# Altium schematic sheet 总体电路图.SCHDOC
size A4
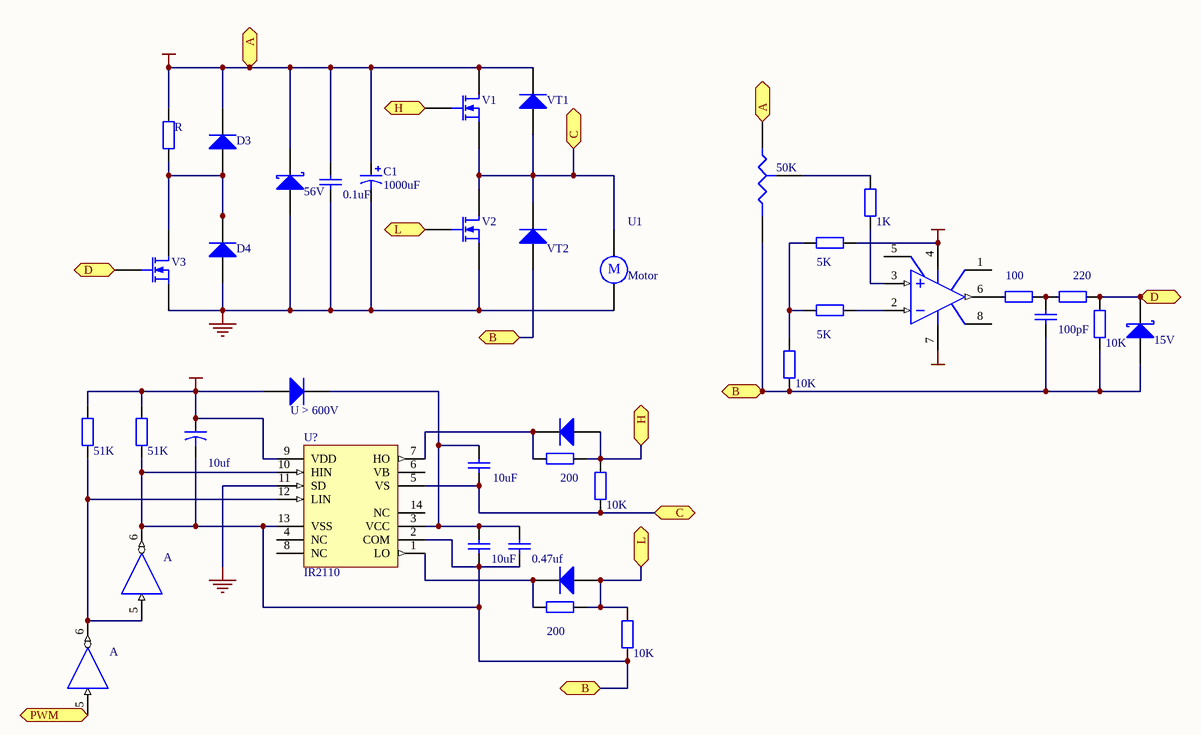
[diagram p0: 总体电路图.SCHDOC]

## Parts
(Parts that share a designator on the sheet are numbered #1, #2 ... from top to bottom, then left to right.)
?#1  value 50K  [VR3]
?#2  56V  [SO-G3/C2.5]
?#3  value 0.1uF  [CAPR2.54-5.1X3.2]
?#4  value 1K  [AXIAL-0.5]
?#5  VT2  [DIO18.84-9.6x5.6]
?#6  Motor  [RB5-10.5]
?#7  value 5K  [AXIAL-0.5]
?#8  value 100  [AXIAL-0.5]
?#9  value 220  [AXIAL-0.5]
?#10  value 5K  [AXIAL-0.5]
?#11  (no value)  [CAN-8/D9.4]
?#12  value 100pF  [CAPR2.54-5.1X3.2]
?#13  value 10K  [AXIAL-0.5]
?#14  15V  [SO-G3/C2.5]
?#15  value 10K  [AXIAL-0.5]
?#16  U > 600V  [DSO-C2/X3.3]
?#17  value 10uf  [CAPR5-4X5]
?#18  value 51K  [AXIAL-0.5]
?#19  value 51K  [AXIAL-0.5]
?#20  value 200  [AXIAL-0.5]
?#21  (no value)  [DSO-C2/X3.3]
?#22  value 10uF  [CAPR2.54-5.1X3.2]
?#23  value 10K  [AXIAL-0.5]
?#24  value 10uF  [CAPR2.54-5.1X3.2]
?#25  value 0.47uf  [CAPR2.54-5.1X3.2]
?#26  (no value)  [FK020D]  (part A of 6)
?#27  (no value)  [DSO-C2/X3.3]
?#28  value 200  [AXIAL-0.5]
?#29  value 10K  [AXIAL-0.5]
?#30  (no value)  [FK020D]  (part A of 6)
C1  1000uF  [CAPPA14.05-10.5x6.3]
D3  (no value)  [DIO18.84-9.6x5.6]
D4  (no value)  [DSO-C2/X3.3]
R  (no value)  [AXIAL-0.5]
U?  IR2110  [PDIP14]
V1  (no value)  [BCY-W3/H.8]
V2  (no value)  [BCY-W3/H.8]
V3  (no value)  [BCY-W3/H.8]
VT1  (no value)  [DIO18.84-9.6x5.6]

## Ports
A, B, C, D, H, L, PWM

## Nets
+15V: ?#7.1 ?#11.4(V-) ?#16.1(A) ?#17.1 ?#18.2 ?#19.2 U?.9(VDD)
+48V: ?#1.1(A) ?#2.3(K) ?#3.2 C1.1 D3.2(K) R.2 V1.1(D) VT1.2(K) ; port A
-15V: ?#11.7(V+)
GND: ?#26.9(GND) ?#26.10(GND) ?#26.11(GND) ?#26.12(GND) ?#30.9(GND) ?#30.10(GND) ?#30.11(GND) ?#30.12(GND)
VCC: ?#2.1(A) ?#3.1 ?#6.2 ?#26.1(VCC) ?#26.20(VCC) ?#30.1(VCC) ?#30.20(VCC) C1.2 D4.1(A) U?.11(SD) V2.3(S) V3.3(S)
B: ?#1.2(B) ?#5.1(A) ?#12.1 ?#13.1 ?#14.1(A) ?#15.2 ?#17.2 ?#19.1 ?#24.1 ?#25.1 ?#26.6(Y) ?#29.1 U?.2(COM) U?.10(HIN) U?.13(VSS) ; port B
C: ?#5.2(K) ?#6.1 ?#22.1 ?#23.1 U?.5(VS) V1.3(S) V2.1(D) VT1.1(A) ; port C
D: ?#9.2 ?#13.2 ?#14.3(K) V3.2(G) ; port D
H: ?#20.2 ?#21.1(A) ?#23.2 V1.2(G) ; port H
L: ?#27.1(A) ?#28.1 ?#29.2 V2.2(G) ; port L
PWM: ?#30.5(A) ; port PWM
Net?#1_3: ?#1.3(TAP) ?#4.2
Net?#4_1: ?#4.1 ?#11.3(IN+)
Net?#7_2: ?#7.2 ?#10.2 ?#15.1
Net?#8_1: ?#8.1 ?#11.6(OUT)
Net?#8_2: ?#8.2 ?#9.1 ?#12.2
Net?#10_1: ?#10.1 ?#11.2(IN-)
Net?#16_2: ?#16.2(K) ?#22.2 ?#24.2 ?#25.2 U?.3(VCC)
Net?#18_1: ?#18.1 ?#26.5(A) ?#30.6(Y) U?.12(LIN)
Net?#20_1: ?#20.1 ?#21.2(K) U?.7(HO)
Net?#27_2: ?#27.2(K) ?#28.2 U?.1(LO)
NetD3_1: D3.1(A) D4.2(K) R.1 V3.1(D)

Not connected (* = marked no-connect by the designer): ?#11 1(OS_NUL) 5(OS_NUL) 8(TAB); U? 4(NC) 6(VB) 8(NC) 14(NC)

## Notes on the sheet
- U1
- (in symbol Motor) M

## Library data of the parts
?#1 = Res Tap: Tapped Resistor; Set Position: 0.5; Published: 24-Mar-1999; Revision: July-2002: Re-released for DXP Platform.; Publisher: Altium Limited
?#2 ?#14 = Diode BAS70: Silicon AF Schottky Diode for High-Speed Switching; Package Information: Latest Revision: Sep-2001; Note: Pin 2 is not connected and not drawn.; Published: 21-Mar-2003; Datasheet: Latest Revision: Oct-1999; Package Reference: SOT-23; Publisher: Altium Limited
?#3 ?#12 = cap: Capacitor; Published: 8-Jun-2000; Revision: July-2002: Re-released for DXP Platform.; Publisher: Altium Limited
?#4 ?#7-?#10 ?#13 ?#15 ?#18-?#20 ?#23 ?#28 ?#29 = Res Semi: Semiconductor Resistor; Published: 8-Jun-2000; Revision: July-2002: Re-released for DXP Platform.; Publisher: Altium Limited
?#5 D3 VT1 = Diode 1N5408: 3 Amp Medium Power Silicon Rectifier Diode; Revision 1: 10-Jul-2000: SIM Model Added.; Revision 2: 17-Jul-2002: Re-released for DXP Platform.; Published: 8-Jun-2000; Datasheet: Latest Revision: Aug-1984; Package Reference: DO-201AD; Publisher: Altium Limited
?#6 = Motor: Motor, General Kind; Published: 24-Mar-1999; Revision: July-2002: Re-released for DXP Platform.; Publisher: Altium Limited
?#11 = Op Amp: FET Operational Amplifier; Published: 8-Jun-2000; Revision: July-2002: Re-released for DXP Platform.; Datasheet: Latest Revision: REV. B; Package Reference: H-08A; Publisher: Altium Limited
?#16 ?#21 ?#27 = Diode: Default Diode; Code - JEDEC: DO-214-AB; Published: 8-Jun-2000; Revision: July-2002: Re-released for DXP Platform.; Publisher: Altium Limited
?#17 = Cap2: Capacitor; Published: 23-Sep-2002; Publisher: Altium Limited
?#22 ?#24 ?#25 = Cap: Capacitor; Published: 8-Jun-2000; Revision: July-2002: Re-released for DXP Platform.; Publisher: Altium Limited
?#26 ?#30 = 54AC11004FK: Hex Inverter; Package Information: Latest Revision: 1998; Note: Pins 2 and 19 are not connected and not drawn; Published: 8-Jun-2000; Revision: 17-Jul-2002: Re-released for DXP Platform.; Datasheet: 1990 Advanced CMOS Logic Data Book (Mar-1990); Package Reference: FK020D; Publisher: Altium Limited
C1 = Cap Pol2: Polarized Capacitor (Axial); Value: 100pF; Published: 8-Jun-2000; Revision: July-2002: Re-released for DXP Platform.; Publisher: Altium Limited
D4 = diode: Default Diode; Code - JEDEC: DO-214-AB; Published: 8-Jun-2000; Revision: July-2002: Re-released for DXP Platform.; Publisher: Altium Limited
R = Res Semi: Semiconductor Resistor; Value: 1K; Published: 8-Jun-2000; Revision: July-2002: Re-released for DXP Platform.; Publisher: Altium Limited
U? = IR2110: High and Low Side Driver; Note: Pins 4, 8 and 14 are not connected; Published: 8-Jun-2000; Revision: 17-Jul-2002: Re-released for DXP Platform.; Datasheet: Latest Revision: PD60147J; Package Reference: PDIP14; Publisher: Altium Limited
V1-V3 = MOSFET-N: N-Channel MOSFET; Published: 8-Jun-2000; Revision: July-2002: Re-released for DXP Platform.; Publisher: Altium Limited